# Altium schematic sheet 03 POWER DIAGRAM.SchDoc
size A2; VersionControl_RevNumber: DNP; IsUserConfigurable: DNP; OrgAddr3: Sunrise FL 33323; OrgName: Pixels on Target; Page Create Date: March  8, 1995; Page Number: 5; Page Size: A2; Page Count: 14; OrgAddr2: Suite #104; RevCode: A; Doc: SCH30-00070-00; DsnPath: C:\Users\Carter Nichols\Documents\BitBucket boards (Cadence)\30-00070-00_Original\SCH30-00070-00.DSN; SchematicName: SC30-00070-00; PageName: 05-POWER IN; PageSize: A2; TopSchematic: True; Address4: United States
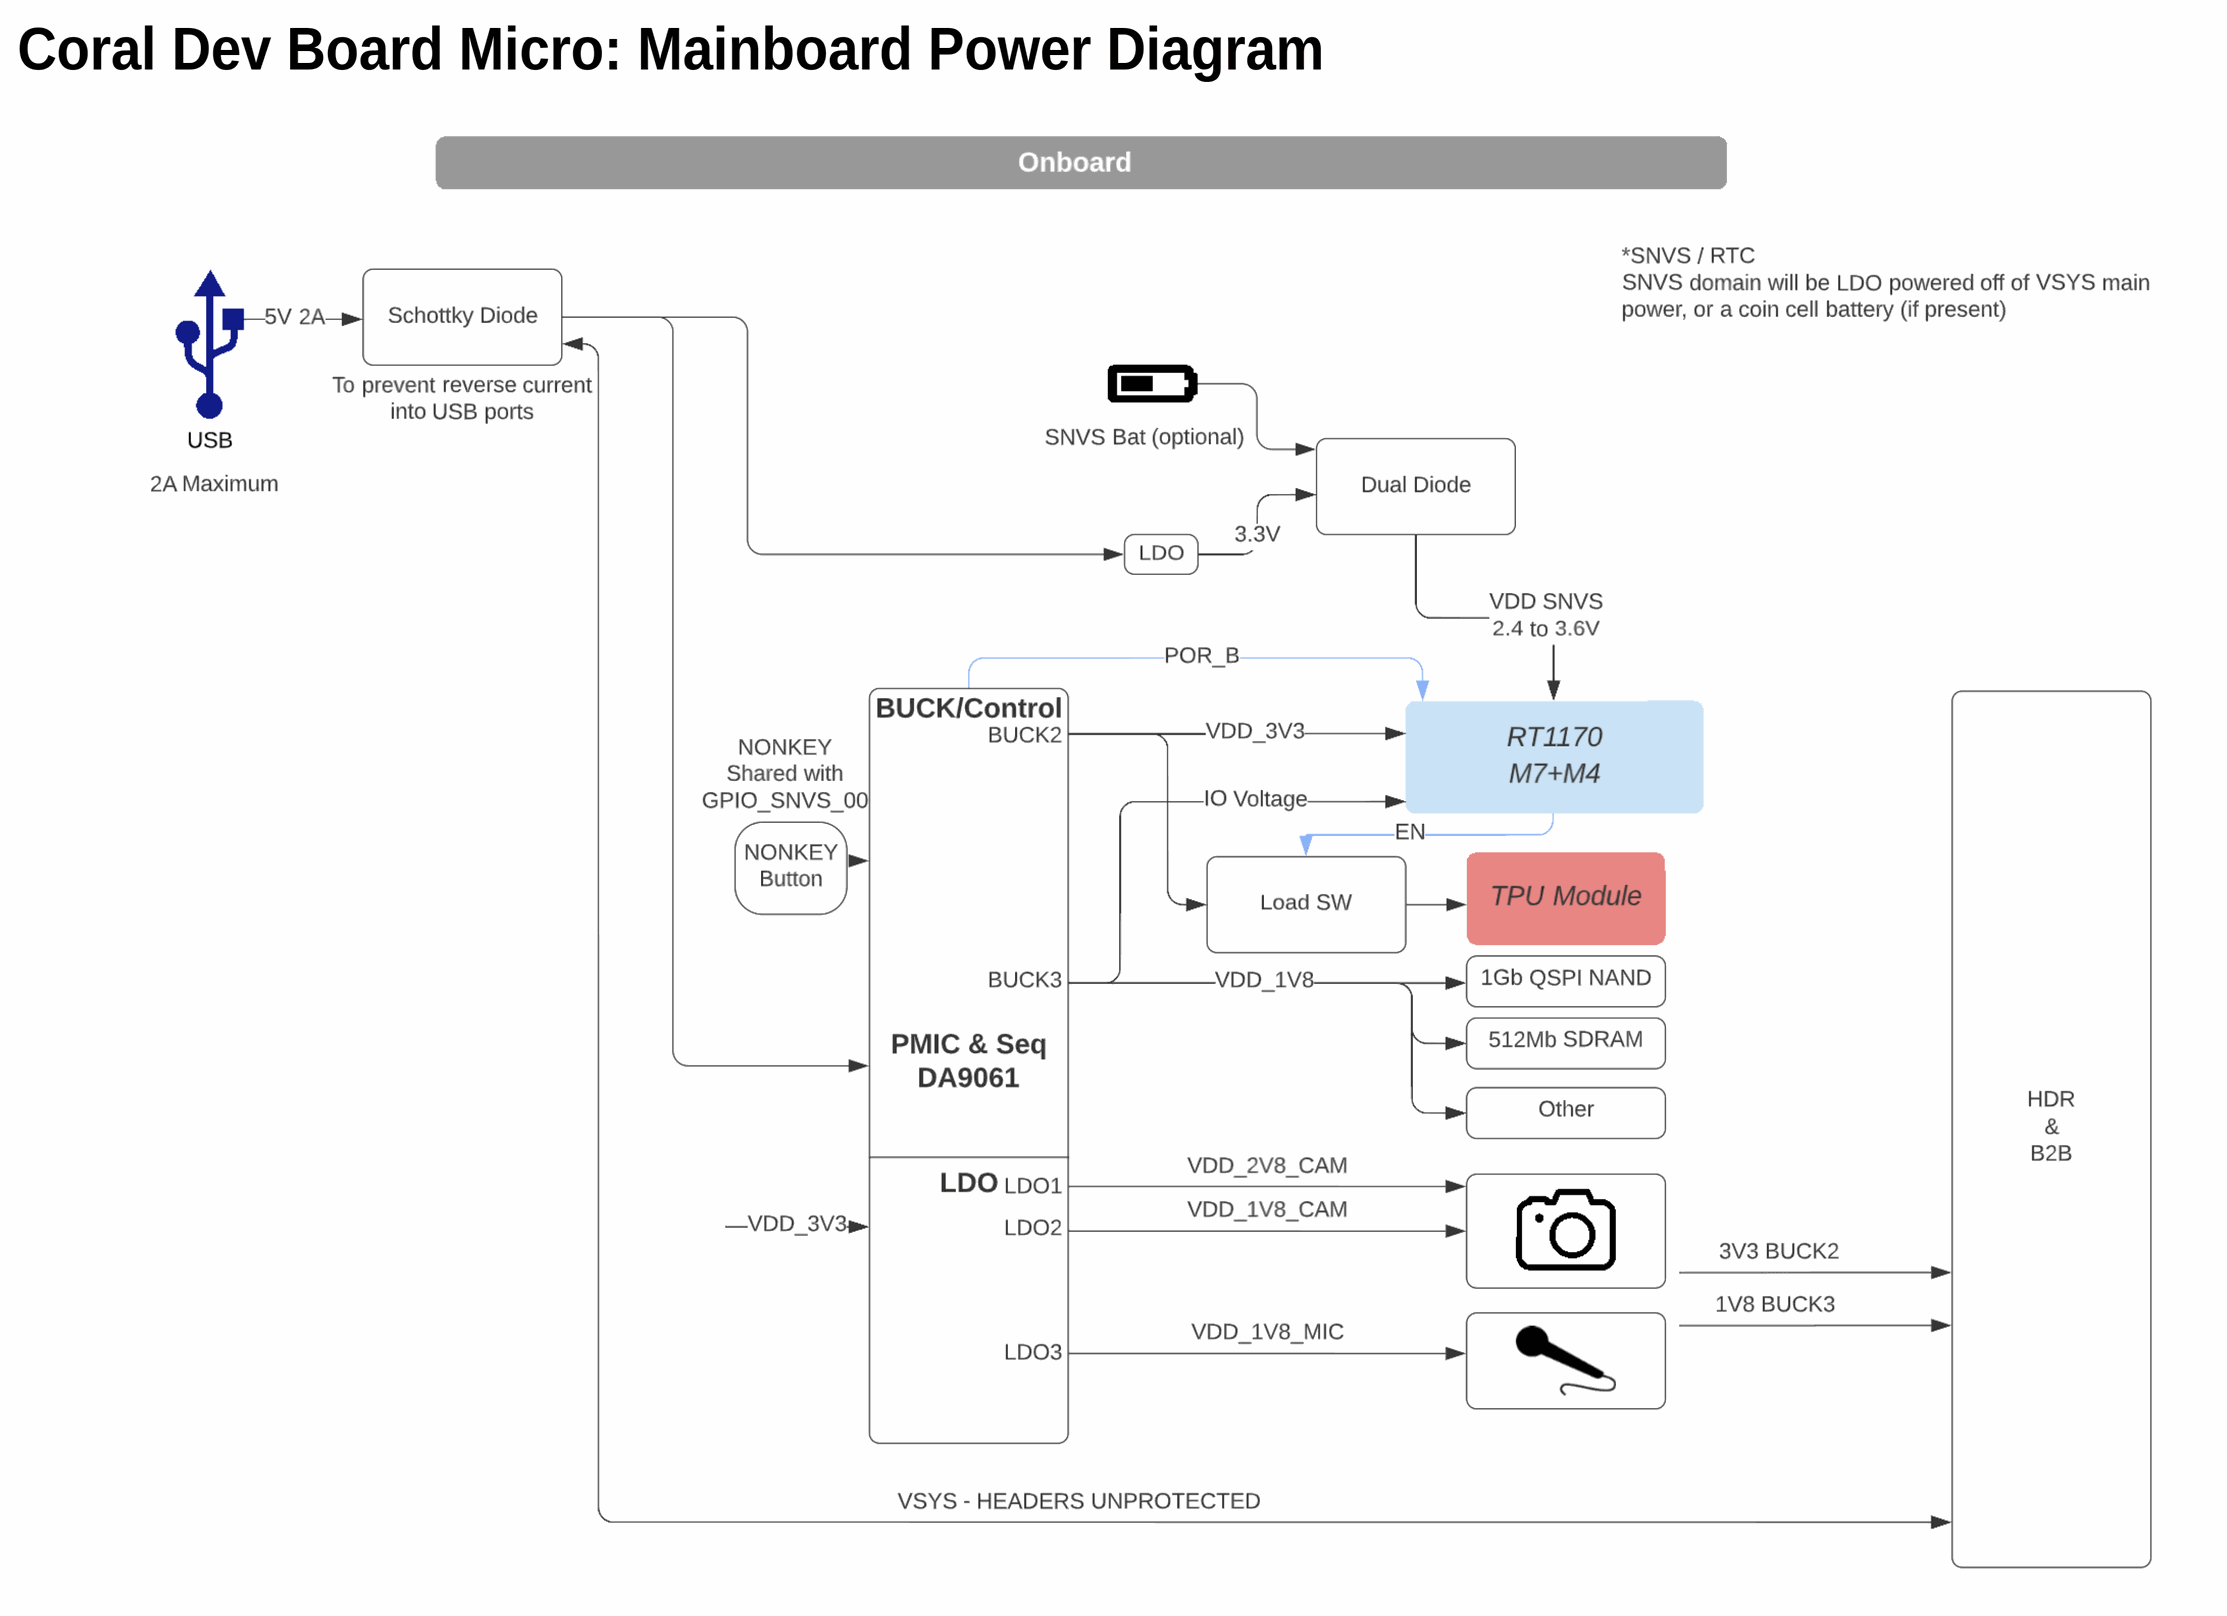
[diagram p0: 03 POWER DIAGRAM.SchDoc]

## Notes on the sheet
- Coral Dev Board Micro: Mainboard Power Diagram
- Title
- Size:
- Date:
- File:
- A2
- Number:
- Time:
- Revision:
- Sheet
- of